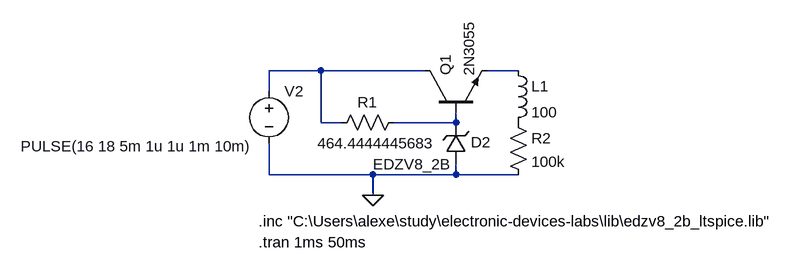
[diagram p0: schematic scheme7.asc]
scheme7.asc, the LTspice schematic file:
Version 4.1
SHEET 1 1416 680
WIRE -32 144 -112 144
WIRE 128 144 -32 144
WIRE 272 144 224 144
WIRE -112 176 -112 144
WIRE -32 224 -32 144
WIRE 0 224 -32 224
WIRE 176 224 176 208
WIRE 176 224 80 224
WIRE -112 304 -112 256
WIRE 48 304 -112 304
WIRE 176 304 176 288
WIRE 176 304 48 304
WIRE 272 304 176 304
WIRE 48 336 48 304
FLAG 48 336 0
SYMBOL voltage -112 160 R0
WINDOW 3 -382 100 Left 2
SYMATTR Value PULSE(16 18 5m 1u 1u 1m 10m)
SYMATTR InstName V2
SYMBOL res 96 208 R90
WINDOW 0 0 56 VBottom 2
WINDOW 3 32 42 VTop 2
SYMATTR InstName R1
SYMATTR Value 464.4444445683
SYMBOL zener 192 288 R180
WINDOW 0 -38 34 Left 2
WINDOW 3 24 0 Left 2
SYMATTR InstName D2
SYMATTR Value EDZV8_2B
SYMBOL res 256 208 R0
SYMATTR InstName R2
SYMATTR Value 100k
SYMBOL npn 128 208 R270
SYMATTR InstName Q1
SYMATTR Value 2N3055
SYMBOL ind 256 128 R0
SYMATTR InstName L1
SYMATTR Value 100
TEXT -128 376 Left 2 !.inc "C:\\Users\\alexe\\study\\electronic-devices-labs\\lib\\edzv8_2b_ltspice.lib"
TEXT -128 408 Left 2 !.tran 1ms 50ms

The netlist it stands for:
* scheme7.asc
V2 N001 0 PULSE(16 18 5m 1u 1u 1m 10m)
R1 N003 N001 464.4444445683
D2 0 N003 EDZV8_2B
R2 P001 0 100k
Q1 N001 N003 N002 0 2N3055
L1 N002 P001 100
.model D D
.lib standard.dio
.model NPN NPN
.model PNP PNP
.lib standard.bjt
.inc "C:\Users\alexe\study\electronic-devices-labs\lib\edzv8_2b_ltspice.lib"
.tran 1ms 50ms
.backanno
.end